# EAGLE design SmartMatrixPhotonApa_V1 (EAGLE 7.6.0)
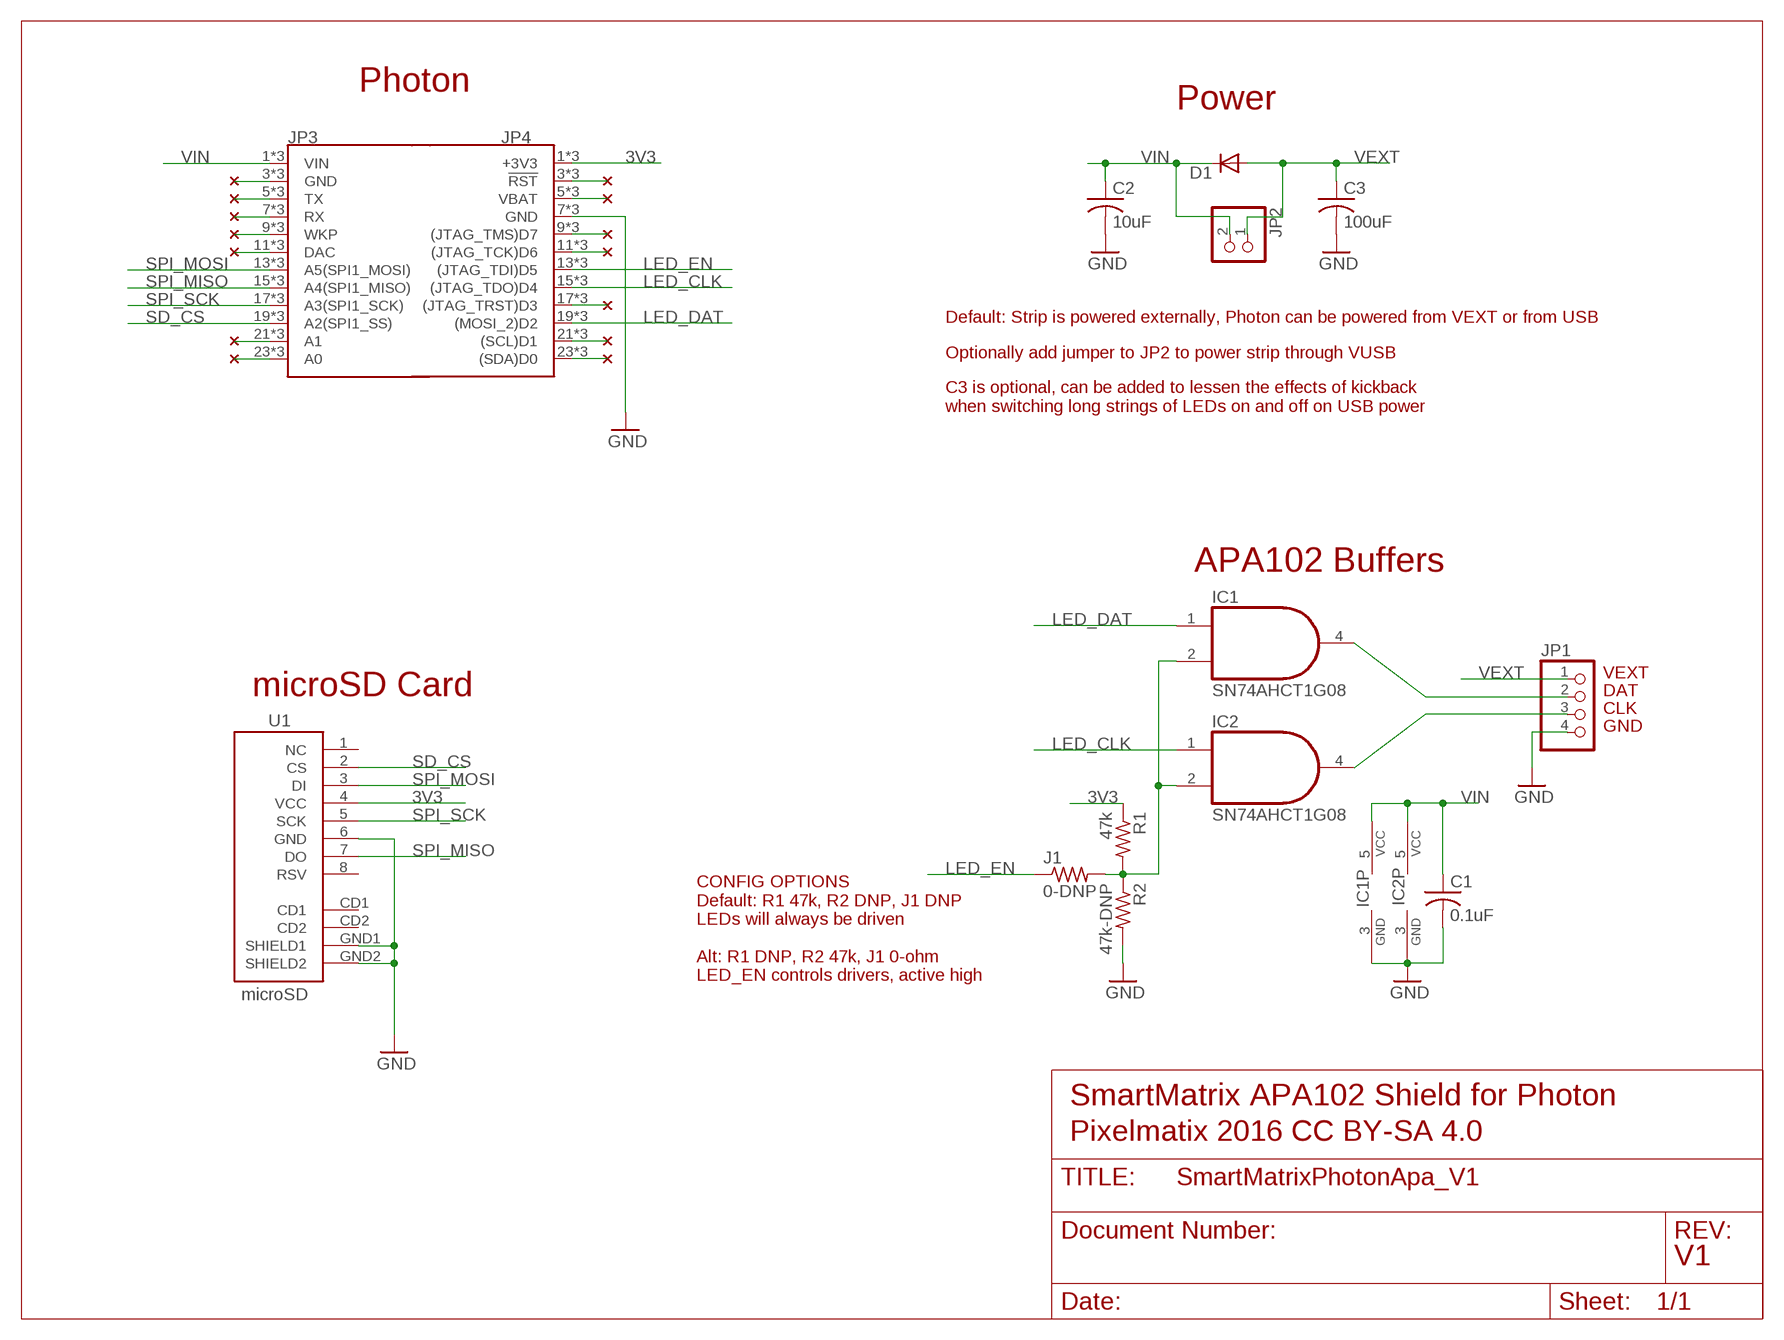
[diagram p0: schematic, sheet 1]

## Parts
C1  0.1uF  C-USC0603  [C0603]
C2  10uF  C-USC0805  [C0805]
C3  100uF  C-USC1206  [C1206]
D1  MBR0520LT  [SOD123]
IC1  74AHC1G08DBV  [SOT23-5]
IC2  74AHC1G08DBV  [SOT23-5]
J1  0-DNP  R-US_R0603  [R0603]
JP1  PINHD-1X04_2.54LARGE  [1X04-LARGEHOLE]
JP2  PINHD-1X02_2.54-SMD-90°  [1X02SMD/90]
JP3  2x12 Female SMT Socket  PARTICLE_PHOTON_LEFT_SHIELD_BOT_MOUNT  [PHOTON_DUAL_HEADER_SHIELD_BOT_MOUNT_LEFT]
JP4  2x12 Female SMT Socket  PARTICLE_PHOTON_RIGHT_SHIELD_BOT_MOUNT  [PHOTON_DUAL_HEADER_SHIELD_BOT_MOUNT_RIGHT]
R1  47k  R-US_R0603  [R0603]
R2  47k-DNP  R-US_R0603  [R0603]
U1  microSD  USD-SOCKETSMD  [MICRO-SD-SOCKET-PP]
U$1  NC  (no package)
U$2  NC  (no package)
U$3  NC  (no package)
U$4  NC  (no package)
U$5  NC  (no package)
U$6  NC  (no package)
U$7  NC  (no package)
U$8  NC  (no package)
U$9  NC  (no package)
U$10  NC  (no package)
U$11  NC  (no package)
U$12  NC  (no package)
U$13  NC  (no package)
U$14  NC  (no package)

## Nets
3V3: JP4.1(+3V3) JP4.2(+3V3) JP4.3V3(+3V3) R1.1 U1.4(VCC)
CLK: IC2.4(O) JP1.3
DAT: IC1.4(O) JP1.2
GND: C1.2 C2.2 C3.2 IC1.3(GND) IC2.3(GND) JP1.4 JP4.7(GND) JP4.8(GND) JP4.GND@2(GND) R2.2 U1.6(GND) U1.GND1(SHIELD1) U1.GND2(SHIELD2)
LED_CLK: IC2.1(I0) JP4.15((JTAG_TDO)D4) JP4.16((JTAG_TDO)D4) JP4.D4((JTAG_TDO)D4)
LED_DAT: IC1.1(I0) JP4.19((MOSI_2)D2) JP4.20((MOSI_2)D2) JP4.D2((MOSI_2)D2)
LED_EN: J1.1 JP4.13((JTAG_TDI)D5) JP4.14((JTAG_TDI)D5) JP4.D5((JTAG_TDI)D5)
N$1: JP3.3(GND) JP3.4(GND) JP3.GND@0(GND) U$1.P$1
N$2: JP3.5(TX) JP3.6(TX) JP3.TX U$2.P$1
N$3: JP3.7(RX) JP3.8(RX) JP3.RX U$3.P$1
N$4: IC1.2(I1) IC2.2(I1) J1.2 R1.2 R2.1
N$5: JP3.9(WKP) JP3.10(WKP) JP3.WKP U$4.P$1
N$6: JP3.11(DAC) JP3.12(DAC) JP3.DAC U$14.P$1
N$7: JP3.21(A1) JP3.22(A1) JP3.A1 U$5.P$1
N$8: JP3.23(A0) JP3.24(A0) JP3.A0 U$6.P$1
N$9: JP4.3(!RST!) JP4.4(!RST!) JP4.RST(!RST!) U$7.P$1
N$10: JP4.5(VBAT) JP4.6(VBAT) JP4.VBAT U$8.P$1
N$11: JP4.9((JTAG_TMS)D7) JP4.10((JTAG_TMS)D7) JP4.D7((JTAG_TMS)D7) U$9.P$1
N$12: JP4.11((JTAG_TCK)D6) JP4.12((JTAG_TCK)D6) JP4.D6((JTAG_TCK)D6) U$10.P$1
N$13: JP4.17((JTAG_TRST)D3) JP4.18((JTAG_TRST)D3) JP4.D3((JTAG_TRST)D3) U$11.P$1
N$14: JP4.21((SCL)D1) JP4.22((SCL)D1) JP4.D1((SCL)D1) U$12.P$1
N$15: JP4.23((SDA)D0) JP4.24((SDA)D0) JP4.D0((SDA)D0) U$13.P$1
SD_CS: JP3.19(A2(SPI1_SS)) JP3.20(A2(SPI1_SS)) JP3.A2(A2(SPI1_SS)) U1.2(CS)
SPI_MISO: JP3.15(A4(SPI1_MISO)) JP3.16(A4(SPI1_MISO)) JP3.A4(A4(SPI1_MISO)) U1.7(DO)
SPI_MOSI: JP3.13(A5(SPI1_MOSI)) JP3.14(A5(SPI1_MOSI)) JP3.A5(A5(SPI1_MOSI)) U1.3(DI)
SPI_SCK: JP3.17(A3(SPI1_SCK)) JP3.18(A3(SPI1_SCK)) JP3.A3(A3(SPI1_SCK)) U1.5(SCK)
VEXT [power]: C3.1 D1.A JP1.1 JP2.1
VIN [power]: C1.1 C2.1 D1.C IC1.5(VCC) IC2.5(VCC) JP2.2 JP3.1(VIN) JP3.2(VIN) JP3.VIN
Unconnected: U1.1(NC) U1.8(RSV) U1.CD1 U1.CD2

## Notes on the sheet
- Photon
- Power
- Default: Strip is powered externally, Photon can be powered from VEXT or from USB
- Optionally add jumper to JP2 to power strip through VUSB
- C3 is optional, can be added to lessen the effects of kickback
  when switching long strings of LEDs on and off on USB power
- APA102 Buffers
- VEXT
- microSD Card | SN74AHCT1G08 | DAT
- CLK
- GND
- SN74AHCT1G08
- CONFIG OPTIONS
  Default: R1 47k, R2 DNP, J1 DNP
  LEDs will always be driven
  
  Alt: R1 DNP, R2 47k, J1 0-ohm
  LED_EN controls drivers, active high
- SmartMatrix APA102 Shield for Photon
- Pixelmatix 2016 CC BY-SA 4.0
- V1

## Library data of the parts
C1-C3 = scanlime:C-US: CAPACITOR, American symbol; PARTNO: CAP CER 0.1UF 10V 10% X7R 0805
D1 = diode:MBR0520LT: SCHOTTKY BARRIER RECTIFIER Source: http://onsemi.com .. MBR0520LT1-D.pdf
IC1 IC2 = 74xx-little-us:74*1G08: 2-input AND gate
J1 R1 R2 = rcl:R-US_: RESISTOR, American symbol
JP1 = eclibrary:PINHD-1X04: PIN HEADER
JP2 = pinhead-2:PINHD-1X02: PIN HEADER
JP3 = eclibrary:PARTICLE_PHOTON_LEFT
JP4 = eclibrary:PARTICLE_PHOTON_RIGHT
U1 = SparkFun:USD-SOCKET: microSD Socket Push-push type uSD socket. Schematic element and footprint production proven. Spark Fun Electronics SKU : PRT-00127. tDoc lines correctly indicate media card edge positions when inserting (unlocked, locked, depressed).
U$1-U$14 = eclibrary:NC

## Net classes
1 power: width 0.406 mm

## Board
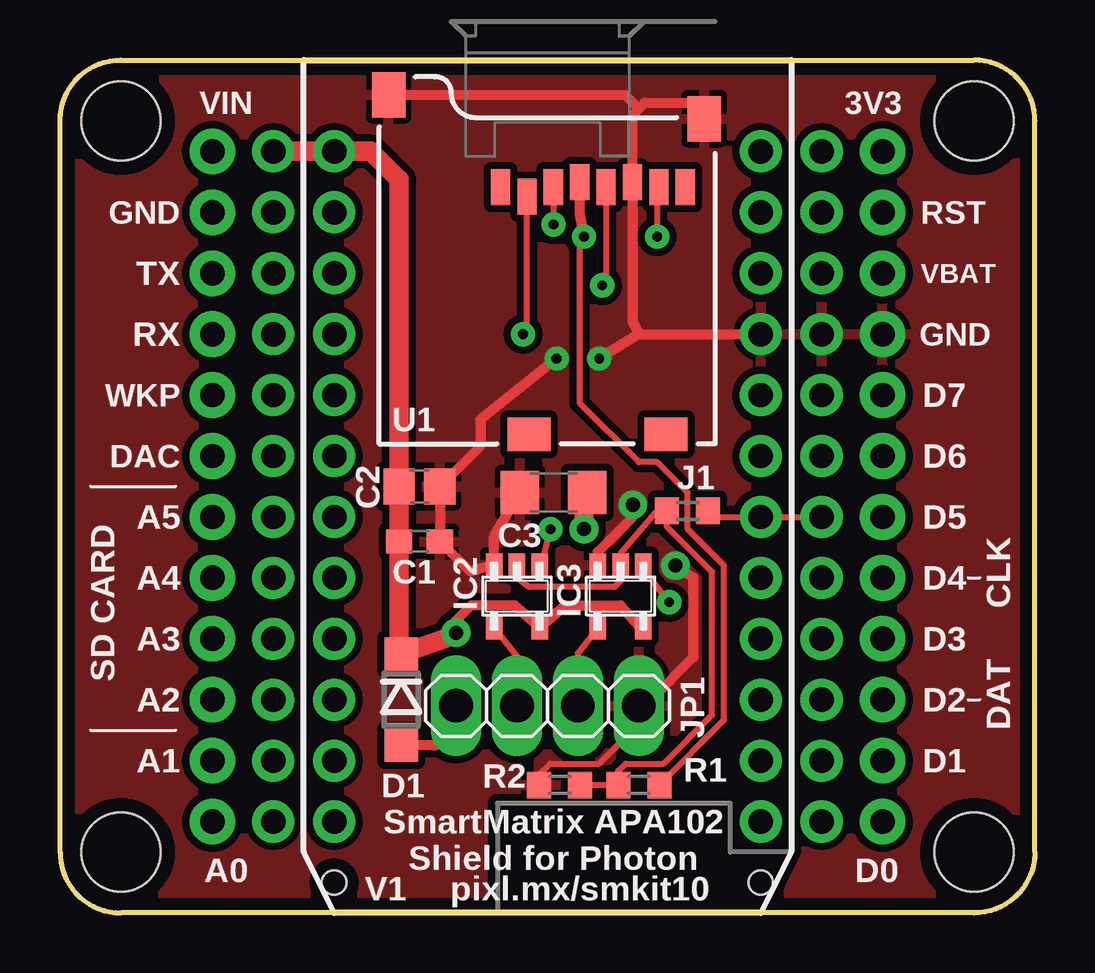
[diagram p1: board, top side]
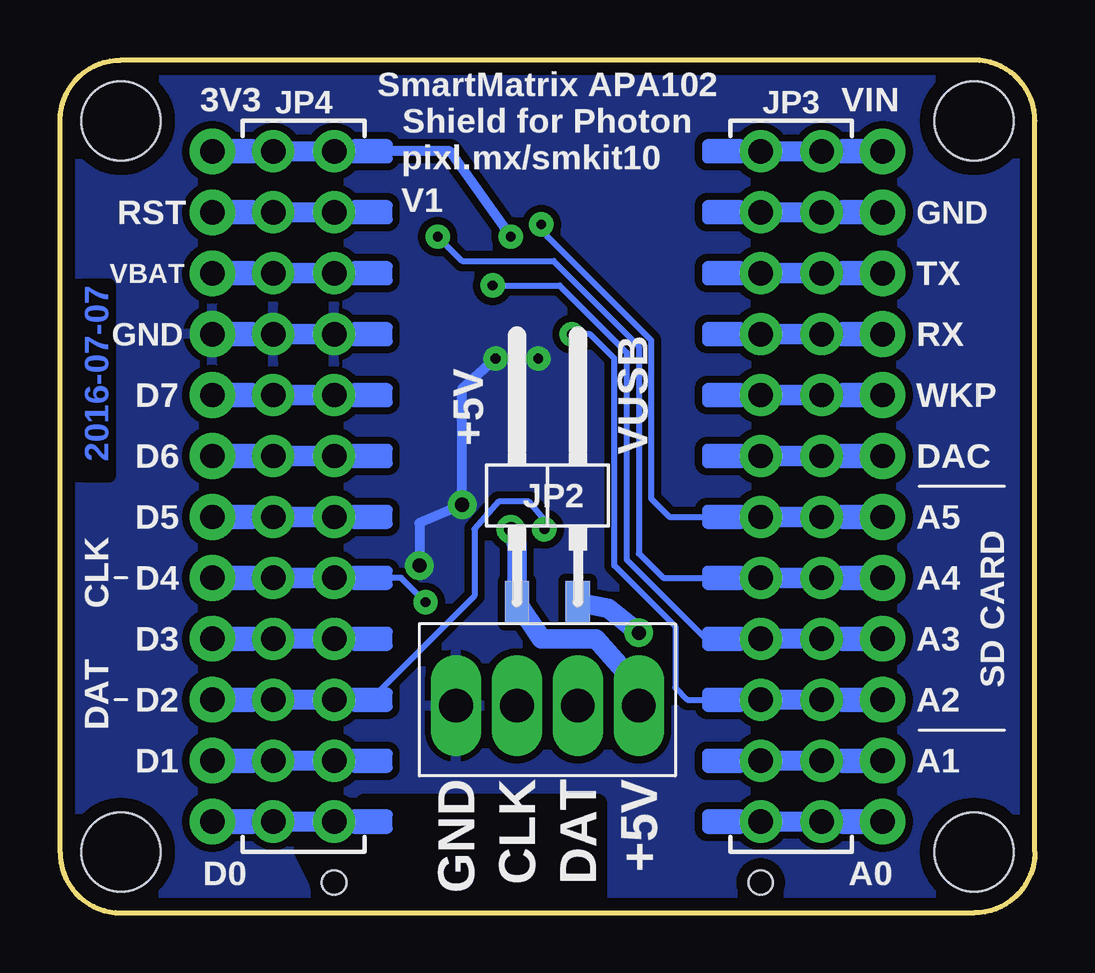
[diagram p2: board, bottom side, seen from below]

Size 40.64 x 35.56 mm. Coordinates in mm from the lower left corner, seen from the top.
Outline: 2.54,35.56 38.1,35.56 arc-90 40.64,33.02 40.64,2.54 arc-90 38.1,0 2.54,0 arc-90 0,2.54 0,33.02 arc-90 2.54,35.56
Copper layers (1*16): Top 0.035mm / dielectric 1.5mm / Bottom 0.035mm
Design rules "SmartProto-Manual-(Recommended)": minimum track width 6mil, minimum drill 12mil, track to track 10mil, track to pad 6mil, pad to pad 12mil, via to via 8mil, smd to smd 0mil, copper to edge 20mil, drill to drill 20mil, minimum pad ring 10mil, minimum via ring 12mil, stop-mask expansion 2mil, vias tented up to drill 100mil, thermal gap 10mil

### Footprints (pad centres in the part's own frame; a part is rotated, then mirrored left to right if it is on the bottom)
C0603 = smd 1.1 x 1: 1 -0.85,0; 2 0.85,0
C0805 = smd 1.3 x 1.5: 1 -0.85,0; 2 0.85,0
C1206 = smd 1.6 x 1.8: 1 -1.4,0; 2 1.4,0
SOD123 = smd 1.4 x 1.4: A 1.9,0; C -1.9,0
SOT23-5 = smd 0.69 x 0.99: 1 -0.95,-1.29; 2 0,-1.29; 3 0.95,-1.29; 4 0.95,1.3; 5 -0.95,1.3
R0603 = smd 1 x 1.1: 1 -0.85,0; 2 0.85,0
1X04-LARGEHOLE = drill 1.4 long: 1 -3.81,0; 2 -1.27,0; 3 1.27,0; 4 3.81,0
1X02SMD/90 = smd 1.016 x 1.778: 1 -1.27,-5.08; 2 1.27,-5.08
PHOTON_DUAL_HEADER_SHIELD_BOT_MOUNT_LEFT = drill 1.016 pad 1.753: 1 -1.27,13.97; 2 1.27,13.97; 3 -1.27,11.43; 4 1.27,11.43; 5 -1.27,8.89; 6 1.27,8.89; 7 -1.27,6.35; 8 1.27,6.35; 9 -1.27,3.81; 10 1.27,3.81; 11 -1.27,1.27; 12 1.27,1.27; 13 -1.27,-1.27; 14 1.27,-1.27; 15 -1.27,-3.81; 16 1.27,-3.81; 17 -1.27,-6.35; 18 1.27,-6.35; 19 -1.27,-8.89; 20 1.27,-8.89; 21 -1.27,-11.43; 22 1.27,-11.43; 23 -1.27,-13.97; 24 1.27,-13.97 | drill 1.016 pad 1.905: A0 3.81,-13.97; A1 3.81,-11.43; A2 3.81,-8.89; A3 3.81,-6.35; A4 3.81,-3.81; A5 3.81,-1.27; DAC 3.81,1.27; GND@0 3.81,11.43; RX 3.81,6.35; TX 3.81,8.89; VIN 3.81,13.97; WKP 3.81,3.81 | hole 3.302: 7.62,15.24; 7.62,-15.24 | hole 1.016: -1.27,-16.51
PHOTON_DUAL_HEADER_SHIELD_BOT_MOUNT_RIGHT = drill 1.016 pad 1.753: 1 -1.27,13.97; 2 1.27,13.97; 3 -1.27,11.43; 4 1.27,11.43; 5 -1.27,8.89; 6 1.27,8.89; 7 -1.27,6.35; 8 1.27,6.35; 9 -1.27,3.81; 10 1.27,3.81; 11 -1.27,1.27; 12 1.27,1.27; 13 -1.27,-1.27; 14 1.27,-1.27; 15 -1.27,-3.81; 16 1.27,-3.81; 17 -1.27,-6.35; 18 1.27,-6.35; 19 -1.27,-8.89; 20 1.27,-8.89; 21 -1.27,-11.43; 22 1.27,-11.43; 23 -1.27,-13.97; 24 1.27,-13.97 | drill 1.016 pad 1.905: 3V3 -3.81,13.97; D0 -3.81,-13.97; D1 -3.81,-11.43; D2 -3.81,-8.89; D3 -3.81,-6.35; D4 -3.81,-3.81; D5 -3.81,-1.27; D6 -3.81,1.27; D7 -3.81,3.81; GND@2 -3.81,6.35; RST -3.81,11.43; VBAT -3.81,8.89 | hole 3.302: -7.62,15.24; -7.62,-15.24 | hole 1.016: 1.27,-16.51
MICRO-SD-SOCKET-PP = smd 0.8 x 1.5: 1 -8.94,10.7; 2 -7.84,10.3; 3 -6.74,10.7; 4 -5.64,10.9; 5 -4.54,10.7; 6 -3.44,10.9; 7 -2.34,10.7; 8 -1.24,10.7 | smd 1.8 x 1.4: CD1 -7.75,0.4; CD2 -2.05,0.4 | smd 1.4 x 1.9: GND1 -13.6,14.55; GND2 -0.45,13.55

### Placement (x,y rotation side)
C1  14.99,15.49 0 top
C2  14.99,17.78 0 top
C3  20.57,17.53 180 top
D1  14.22,8.89 270 top
IC1  19.05,13.21 180 top
IC2  23.37,13.21 180 top
J1  26.16,16.76 180 top
JP1  20.32,8.64 0 top
JP2  20.32,18.03 0 bottom
JP3  10.16,17.78 0 bottom
JP4  30.48,17.78 0 bottom
R1  24.13,5.33 180 top
R2  20.83,5.33 180 top
U1  27.3,19.56 0 top

### Tracks (layer width: path | path; a pad name or v marks a point on that pad's centre or on a via)
3V3  (via drill 0.41)
  Top 0.254: 21.66,29.14 21.66,21.26 24.13,18.8 24.89,18.8 26.16,17.53 26.16,16 27.69,14.48 27.69,8.04 R1.1
  Top 0.406: U1.4 21.66,29.14 v21.84,28.19
  Bottom 0.406: v21.84,28.19 24.38,31.75 JP4.2 JP4.1 JP4.3V3
CLK
  Top 0.254: IC2.4 21.59,10.83 JP1.3
DAT
  Top 0.254: IC1.4 19.05,10.7 JP1.2
GND  (via drill 0.41, 0.58 pad 0.58)
  Top 0.254: R2.2 19.98,5.75 20.45,6.22 22.48,6.22 24.13,7.87 JP1.4
  Top 0.406: 24.13,24.13 23.86,24.65 U1.6 23.86,33.26 24.13,33.53 | 24.13,24.13 JP4.8 | 24.13,33.53 24.38,33.78 26.77,33.78 U1.GND2 | U1.GND1 23.55,34.11 24.13,33.53 | v23.88,17.02 23.88,16.51 22.42,15.05 IC2.3 | 24.13,24.13 v22.48,23.11 | v20.7,23.11 17.53,20.57 17.53,19.47 C2.2 C1.2 17.09,14.24 IC1.3 18.1,15.69 C3.2 | JP1.4 24.64,8.89 26.42,10.67 26.42,13.97 v25.65,14.48
  Bottom 0.406: v20.7,23.11 v22.48,23.11 23.88,21.84 v23.88,17.02 25.65,16.26 v25.65,14.48
  pour Bottom (isolate 0.305): 0,35.56 40.64,35.56 40.64,0 0,0
  pour Top (isolate 0.305): 0,35.56 40.64,35.56 40.64,0 0,0
LED_CLK  (via drill 0.41)
  Top 0.254: IC2.1 24.36,14.24 v25.4,12.95
  Bottom 0.254: v25.4,12.95 26.42,13.97 28.7,13.97
  Bottom 0.406: 28.7,13.97 JP4.16 JP4.15 JP4.D4
LED_DAT  (via drill 0.41)
  Top 0.254: IC1.1 20.02,14.22 v20.45,16
  Bottom 0.254: JP4.20 27.69,8.89 23.37,13.21 23.37,16 22.35,17.14 21.08,17.14 20.45,16.38 v20.45,16
  Bottom 0.406: JP4.20 JP4.19 JP4.D2
LED_EN
  Top 0.254: J1.1 27.43,16.51 JP4.13
  Bottom 0.406: JP4.13 31.5,16.51 | JP4.D5 JP4.13 | JP4.14 JP4.13
N$1
  Bottom 0.406: JP3.3 JP3.4 JP3.GND@0
N$2
  Bottom 0.406: JP3.TX JP3.6 JP3.5
N$3
  Bottom 0.406: JP3.7 JP3.8 JP3.RX
N$4
  Top 0.254: 23.37,14.48 IC2.2 | IC2.2 23.37,13.84 23.11,13.59 19.56,13.59 19.05,13.97 IC1.2 | IC2.2 23.37,14.99 24.8,16.68 J1.2 25.31,16.09 27.18,14.22 27.18,8.26 25.15,6.22 23.57,6.22 23.28,5.93 R1.2 R2.1
N$5
  Bottom 0.406: JP3.WKP JP3.10 JP3.9
N$6
  Bottom 0.406: JP3.DAC JP3.12 JP3.11
N$7
  Bottom 0.406: JP3.21 JP3.22 JP3.A1
N$8
  Bottom 0.406: JP3.A0 JP3.24 JP3.23
N$9
  Bottom 0.406: JP4.4 JP4.3 JP4.RST
N$10
  Bottom 0.406: JP4.VBAT JP4.5 JP4.6
N$11
  Bottom 0.406: JP4.D7 JP4.9 JP4.10
N$12
  Bottom 0.406: JP4.12 JP4.11 JP4.D6
N$13
  Bottom 0.406: JP4.D3 JP4.17 JP4.18
N$14
  Bottom 0.406: JP4.D1 JP4.21 JP4.22
N$15
  Bottom 0.406: JP4.24 JP4.23 JP4.D0
SD_CS  (via drill 0.41)
  Top 0.254: 19.46,24.29 U1.2
  Top 0.406: v19.3,24.13 19.46,24.29
  Bottom 0.254: v19.3,24.13 18.54,24.13 17.53,23.11 17.53,14.48 14.99,11.94 14.99,9.4 14.48,8.89 JP3.19
  Bottom 0.406: JP3.A2 JP3.20 JP3.19
SPI_MISO  (via drill 0.41)
  Top 0.254: U1.7 24.89,30.18 v24.89,28.19
  Bottom 0.254: v24.89,28.19 23.88,27.18 20.07,27.18 16.51,23.62 16.51,14.99 15.49,13.97 JP3.15
  Bottom 0.406: JP3.A4 JP3.16 JP3.15
SPI_MOSI  (via drill 0.41)
  Top 0.254: U1.3 20.57,29.73 v20.57,28.7
  Bottom 0.254: v20.57,28.7 20.32,28.19 16,23.88 16,17.27 15.24,16.51 JP3.13
  Bottom 0.406: JP3.13 JP3.14 JP3.A5
SPI_SCK  (via drill 0.41)
  Top 0.254: U1.5 22.77,26.57 v22.61,26.16
  Bottom 0.254: v22.61,26.16 19.81,26.16 17.02,23.37 17.02,14.73 13.72,11.43 JP3.17
  Bottom 0.406: JP3.17 JP3.18 JP3.A3
VEXT  (via drill 0.58)
  Top 0.406: JP1.1 16.51,7.87 15.62,6.99 D1.A | 21.84,16.89 C3.1
  Top 0.813: v21.84,16 21.84,16.89
  Bottom 0.813: JP1.1 16.51,9.4 18.29,11.43 20.57,11.43 JP2.1 21.59,15.37 v21.84,16
VIN  (via drill 0.58)
  Top 0.406: IC2.5 24.32,11.75 23.37,12.83 21.05,12.83 IC1.5 18.95,12.83 17.14,12.83 16.51,12.19 v16.51,11.68 | 14.22,10.92 14.14,11.09
  Top 0.813: 14.22,10.92 D1.C 16,11.43 v16.51,11.68 | 14.14,11.09 C1.1 C2.1 14.14,30.57 12.95,31.75 JP3.2
  Bottom 0.406: JP3.VIN JP3.2 JP3.1
  Bottom 0.813: v16.51,11.68 17.78,12.7 JP2.2

### Text on the board
Bottom: 2016-07-07
tPlace: IC2 | CLK | IC3 | SD CARD | DAT | SmartMatrix APA102 / Shield for Photon | V1 | pixl.mx/smkit10
bPlace: SmartMatrix APA102 / Shield for Photon | pixl.mx/smkit10 | V1 | VUSB | +5V | CLK | SD CARD | DAT | +5V | DAT | CLK | GND
Document: SmartMatrix APA102 Shield for Photon | Pixelmatix 2016 CC BY-SA 4.0 | Rev V1 | Photon Shield Footprint originally by SparkFun, CC BY-SA 4.0 | Photon SMT Breakout Footprint originally by Particle